# Altium schematic sheet WiFan.SchDoc: WiFan
size Letter; Author: Brandon Harris; Revision: 1.0; SheetNumber: 1; SheetTotal: 1; PageSetup: Record=PageOptions|CenterHorizontal=True|CenterVertical=True|PrintScale=0.62|XCorrection=1.00|YCorrection=1.00|PrintKind=0|BorderSize=5000000|LeftOffset=0|BottomOffset=0|Orientation=2|PaperLength=1000|PaperWidth=1000|Scale=100|PaperSource=7|PrintQuality=600|MediaType=1|DitherType=10|PaperKind=Tabloid|PrintScaleMode=1; ProjectName: WiFan
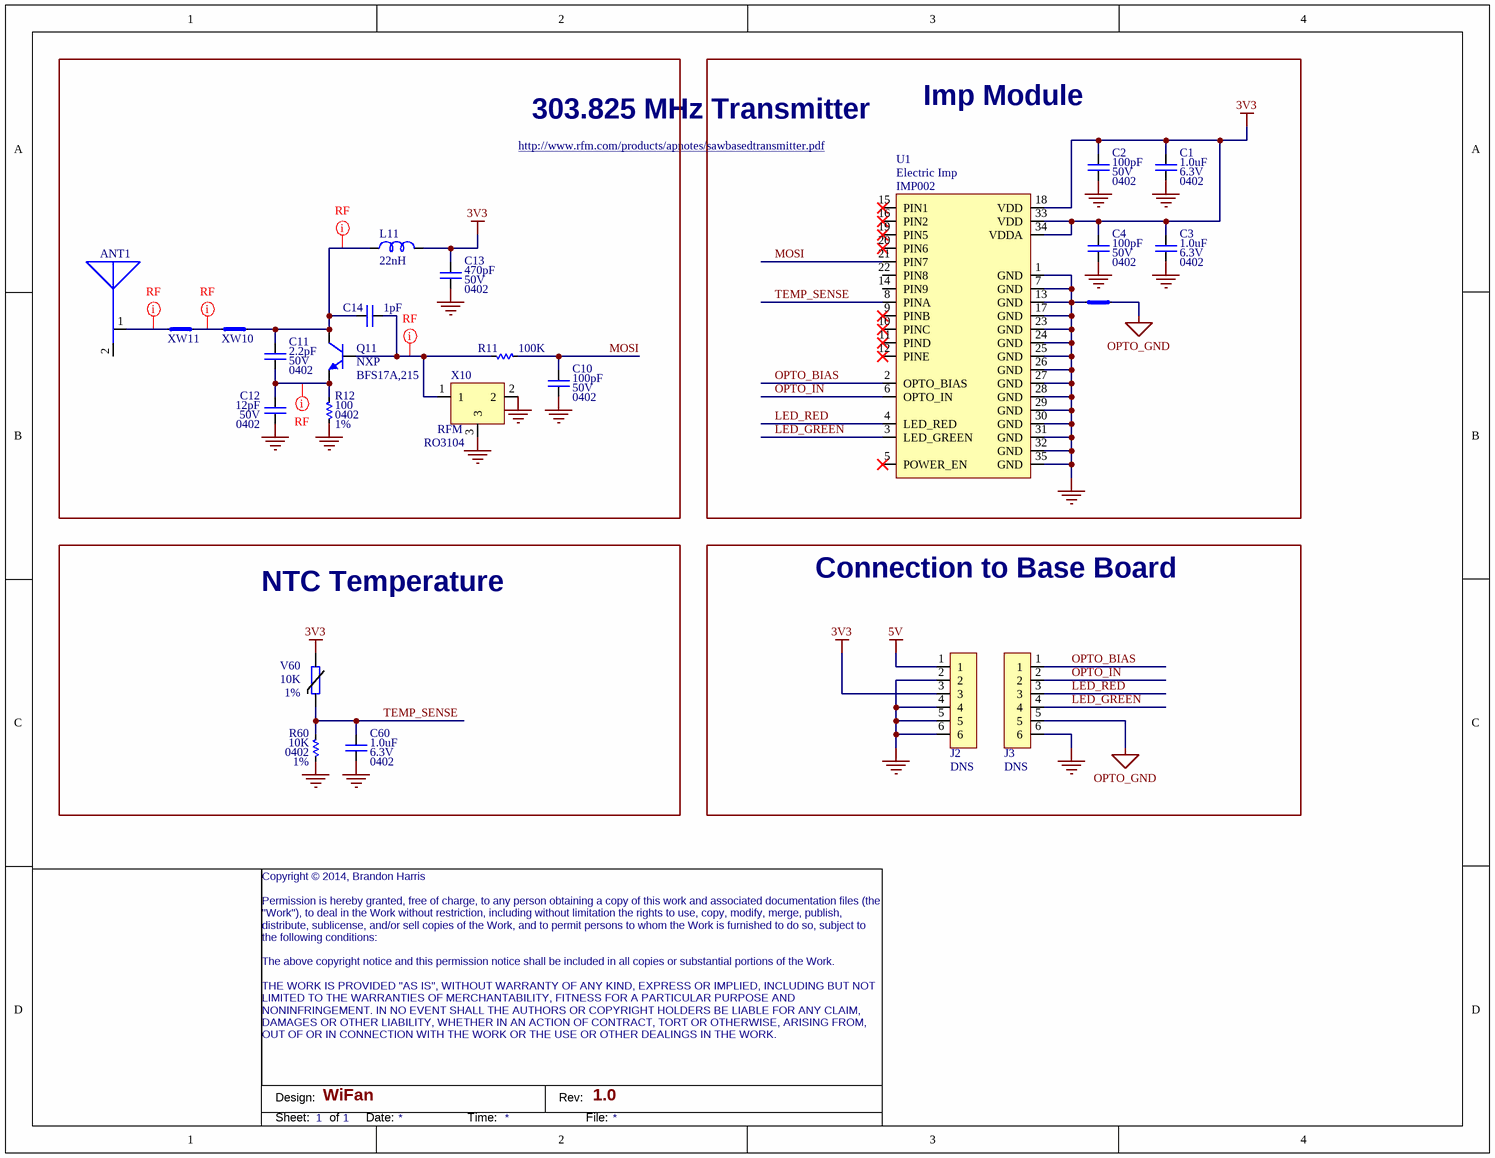
[diagram p0: WiFan.SchDoc]

## Parts
ANT1  ANT  [ANT-433-HETH]  (value not drawn)
C1  value 1.0uF  Voltage: 6.3V  Package: 0402  [CAPC1005X07N]  (hidden comment: Ceramic Capacitor)
C2  value 100pF  Voltage: 50V  Package: 0402  [CAPC1005X07N]  (hidden comment: Ceramic Capacitor)
C3  value 1.0uF  Voltage: 6.3V  Package: 0402  [CAPC1005X07N]  (hidden comment: Ceramic Capacitor)
C4  value 100pF  Voltage: 50V  Package: 0402  [CAPC1005X07N]  (hidden comment: Ceramic Capacitor)
C10  value 100pF  Voltage: 50V  Package: 0402  [CAPC1005X07N]  (hidden comment: Ceramic Capacitor)
C11  value 2.2pF  Voltage: 50V  Package: 0402  [CAPC1005X07N]  (hidden comment: Ceramic Capacitor)
C12  value 12pF  Voltage: 50V  Package: 0402  [CAPC1005X07N]  (hidden comment: Ceramic Capacitor)
C13  value 470pF  Voltage: 50V  Package: 0402  [CAPC1005X07N]  (hidden comment: Ceramic Capacitor)
C14  value 1pF  [CAPC1005X07N]  (hidden comment: Ceramic Capacitor)
C60  value 1.0uF  Voltage: 6.3V  Package: 0402  [CAPC1005X07N]  (hidden comment: Ceramic Capacitor)
J2  BOMOPTION: DNS  [HDR254P1X6-N]  (hidden comment: Header)  (no BOM)
J3  BOMOPTION: DNS  [HDR254P1X6-N]  (hidden comment: Header)  (no BOM)
L11  value 22nH  [INDC1005X06N]  (hidden comment: Inductor)
Q11  Manufacturer: NXP  Manufacturer Part Number: BFS17A,215  [SOT95P300X130-3N]  (hidden comment: NPN Bipolar Transistor)
R11  value 100K  [RESC1005X04N]  (hidden comment: Resistor)
R12  value 100  Package: 0402  Tolerance: 1%  [RESC1005X04N]  (hidden comment: Resistor)
R60  value 10K  Package: 0402  Tolerance: 1%  [RESC1005X04N]  (hidden comment: Resistor)
U1  Manufacturer: Electric Imp  Manufacturer Part Number: IMP002  [IMP_MODULE]  (hidden comment: imp module)
V60  value 10K  Precision: 1%  [HDR1X2]  (hidden comment: VARISTOR)
X10  Manufacturer: RFM  Manufacturer Part Number: RO3104  [TO39-3]  (hidden comment: RESONATOR-3N)
XW1  XW Link  [XW1005-COVERED]  (value not drawn)  (net tie, no BOM)
XW10  XW Link  [XW1005-UNCOVERED]  (value not drawn)  (net tie, no BOM)
XW11  XW Link  [XW1005-UNCOVERED]  (value not drawn)  (net tie, no BOM)

## Blocks framed on the sheet
303.825 MHz Transmitter: ANT1 C10-C14 L11 Q11 R11 R12 X10 XW10 XW11
Imp Module: C1-C4 U1 XW1
NTC Temperature: C60 R60 V60
Connection to Base Board: J2 J3

## Nets
3V3: C1.2 C2.2 C3.2 C4.2 C13.2 J2.3 L11.1 U1.18(VDD) U1.33(VDD) U1.34(VDDA) V60.1
5V: J2.1
GND: C1.1 C2.1 C3.1 C4.1 C10.1 C12.1 C13.1 C60.1 J2.2 J2.4 J2.5 J2.6 J3.6 R12.1 R60.1 U1.1(GND) U1.7(GND) U1.13(GND) U1.17(GND) U1.23(GND) U1.24(GND) U1.25(GND) U1.26(GND) U1.27(GND) U1.28(GND) U1.29(GND) U1.30(GND) U1.31(GND) U1.32(GND) U1.35(GND) X10.2 X10.3 XW1.1
OPTO_GND: J3.5 XW1.2
LED_GREEN: J3.4 U1.3(LED_GREEN)
LED_RED: J3.3 U1.4(LED_RED)
MOSI: C10.2 R11.1 U1.21(PIN7)
OPTO_BIAS: J3.1 U1.2(OPTO_BIAS)
OPTO_IN: J3.2 U1.6(OPTO_IN)
TEMP_SENSE: C60.2 R60.2 U1.8(PINA) V60.2
NetANT1_1: ANT1.1 XW11.2
NetC11_1: C11.1 C12.2 Q11.2(E) R12.2
NetC11_2: C11.2 C14.1 L11.2 Q11.3(C) XW10.1
NetC14_2: C14.2 Q11.1(B) R11.2 X10.1
NetXW10_2: XW10.2 XW11.1

Not connected (* = marked no-connect by the designer): ANT1 2; U1 5(POWER_EN)* 9(PINB)* 10(PINC)* 11(PIND)* 12(PINE)* 14(PIN9) 15(PIN1)* 16(PIN2)* 19(PIN5)* 20(PIN6)* 22(PIN8)

## Layout directives
net class RF: NetANT1_1, NetC11_1, NetC11_2, NetC14_2, NetXW10_2

## Notes on the sheet
- http://www.rfm.com/products/apnotes/sawbasedtransmitter.pdf
- Copyright © 2014, Brandon Harris
  Permission is hereby granted, free of charge, to any person obtaining a copy of this work and associated documentation files (the "Work"), to deal in the Work without restriction, including without limitation the rights to use, copy, modify, merge, publish, distribute, sublicense, and/or sell copies of the Work, and to permit persons to whom the Work is furnished to do so, subject to the following conditions:
  The above copyright notice and this permission notice shall be included in all copies or substantial portions of the Work.
  THE WORK IS PROVIDED "AS IS", WITHOUT WARRANTY OF ANY KIND, EXPRESS OR IMPLIED, INCLUDING BUT NOT LIMITED TO THE WARRANTIES OF MERCHANTABILITY, FITNESS FOR A PARTICULAR PURPOSE AND NONINFRINGEMENT. IN NO EVENT SHALL THE AUTHORS OR COPYRIGHT HOLDERS BE LIABLE FOR ANY CLAIM, DAMAGES OR OTHER LIABILITY, WHETHER IN AN ACTION OF CONTRACT, TORT OR OTHERWISE, ARISING FROM, OUT OF OR IN CONNECTION WITH THE WORK OR THE USE OR OTHER DEALINGS IN THE WORK.
- Design:
- Rev:
- Sheet:
- of
- Date:
- Time:
- File:

## Library data of the parts
ANT1 = ANT00001: Antenna, 433 MHz, through-hole, helical, air core; Manufacturer: Linx Technologies; Frequency: 433 MHz; Bands: 1; Part Number: ANT00001; Package: Through-hole; Type: Helical; Gain: -; VSWR: -; Manufacturer Part Number: ANT-433-HETH; Supplier 1: Digi-Key; Supplier Part Number 1: ANT-433-HETH-ND; Supplier Price 1: 0.675; ComponentLink1URL: http://www.digikey.com/product-detail/en/ANT-433-HETH/ANT-433-HETH-ND/625468
C1 C3 C60 = CAPC00005: CAP,X5R,1.0uF,10%,6.3V, 0402,#; Manufacturer: Murata; Manufacturer Part Number: GRM155R60J105KE19D; Tolerance: 10%; Dielectric: X5R; Part Number: CAPC00005; Manufacturer 2: Samsung; Manufacturer Part Number 2: CL05A105KQ5NNNC; Supplier 1: Digi-Key; Supplier Part Number 1: 490-1320-1-ND; Supplier Price 1: 0.0087; Supplier 2: Digi-Key; Supplier Part Number 2: 1276-1010-1-ND; Supplier Price 2: 0.009; Stock Quantity: 1000; Stock Date: 3/12/2013
C2 C4 C10 = CAPC00043: CAP,C0G,100pF,5%,50V,0402; Manufacturer: Yageo; Manufacturer Part Number: CC0402JRNPO9BN101; Tolerance: 5%; Dielectric: C0G; Part Number: CAPC00043; Manufacturer 2: Samsung; Manufacturer Part Number 2: CL05C101JB5NNNC; Supplier 1: Digi-Key; Supplier Part Number 1: 311-1024-1-ND; Supplier Price 1: 0.00324; Supplier 2: Digi-Key; Supplier Part Number 2: 1276-1025-1-ND; Supplier Price 2: 0.00324; Stock Quantity: 500; Stock Date: 3/12/2013
C11 = CAPC00080: CAP,C0G,2.2pF,+/-0.25pF,50V,0402; Manufacturer: Yageo; Manufacturer Part Number: CC0402CRNPO9BN2R2; Tolerance: 0.25p; Dielectric: C0G; Part Number: CAPC00080; Manufacturer 2: TDK; Manufacturer Part Number 2: CGA2B2C0G1H2R2C050BA; Supplier 1: Digi-Key; Supplier Part Number 1: 311-1354-1-ND; Supplier Price 1: 0.00426; Supplier 2: Digi-Key; Supplier Part Number 2: 445-5573-1-ND; Supplier Price 2: 0.015
C12 = CAPC00041: CAP,C0G,12pF,5%,50V,0402#; Manufacturer: Yageo; Manufacturer Part Number: CC0402JRNPO9BN120; Tolerance: 5%; Dielectric: C0G; Part Number: CAPC00041; Manufacturer 2: Murata; Manufacturer Part Number 2: GRM1555C1H120JZ01D; Supplier 1: Digi-Key; Supplier Part Number 1: 311-1016-1-ND; Supplier Price 1: 0.00324; Supplier 2: Digi-Key; Supplier Part Number 2: 490-1279-1-ND; Supplier Price 2: 0.00525
C13 = CAPC00047: CAP,C0G,470pF,5%,50V,0402; Manufacturer: TDK; Manufacturer Part Number: C1005C0G1H471J; Tolerance: 5%; Dielectric: C0G; Part Number: CAPC00047; Manufacturer 2: Murata; Manufacturer Part Number 2: GRM1555C1H471JA01D; Supplier 1: Digi-Key; Supplier Part Number 1: 445-2656-1-ND; Supplier Price 1: 0.0108; Supplier 2: Digi-Key; Supplier Part Number 2: 490-1297-1-ND; Supplier Price 2: 0.0177; Stock Quantity: 50; Stock Date: 5/6/2013
C14 = CAPC00081: CAP,NPO,1pF, 0402, 50V; Manufacturer: Samsung; Manufacturer Part Number: CL05C010CB5NNNC; Tolerance: 0.25p; Dielectric: C0G; Voltage: 50V; Package: 0402; Part Number: CAPC00081; Manufacturer 2: Murata; Manufacturer Part Number 2: GRM1555C1H1R0CA01D; Supplier 1: Digi-Key; Supplier Part Number 1: 1276-1595-1-ND; Supplier Price 1: 0.00432; Supplier 2: Digi-Key; Supplier Part Number 2: 490-3199-1-ND; Supplier Price 2: 0.00525
J2 J3 = HDR00020: Spacer, 1x6 Pin, 2.54mm Pitch, 0.661" Stack Height, Vertical, Through Hole; Manufacturer: Harwin; Manufacturer Part Number: M20-9610646; Gender: Male; Number of Columns: 6; Part Number: HDR00020; Connector Type: Spacer; Number of Rows: 1; Number of Positions Loaded: 6; Pitch: 2.54mm; Mounting Type: Through Hole; Orientation: Vertical; Contact Finish: Gold Flash; Supplier 1: Digi-Key; Supplier Part Number 1: 952-1981-ND; Supplier Price 1: 0.3723
L11 = IND00036: IND, 22nH, 5%, 300mA, 600 mOhm, 0402; Manufacturer: Taiyo Yuden; Manufacturer Part Number: HK100522NJ-T; Part Number: IND00036; Package: 0402; Current: 300mA; Current - Saturation: -; Current - Temperature Rise: -; Tolerance: 5%; DC Resistance (DCR): 600 mOhm; Supplier 1: Digi-Key; Supplier Part Number 1: 587-1523-1-ND; Supplier Price 1: 0.01125; ComponentLink1URL: http://www.digikey.com/product-detail/en/HK100522NJ-T/587-1523-1-ND/1008138
Q11 = NPN00003: NPN,15V, 25mA, 2.8GHz, SOT23; DC Current Gain (hFE) (Min) @ Ic, Vce: 25 @ 2mA, 1V; Power - Max: 300mW; Part Number: NPN00003; Package: SOT23; Current - Collector (Ic) (Max): 25mA; Voltage - Collector Emitter Breakdown (Max): 15V; Vce Saturation (Max) @ Ib, Ic: -; Current - Collector Cutoff (Max): -; Supplier 1: Digi-key; Supplier Part Number 1: 568-1653-1-ND; Supplier Price 1: 0.07066; ComponentLink1URL: http://www.digikey.com/product-detail/en/BFS17A,215/568-1653-1-ND/763480
R11 = RES00001: RES,100k,5%,0.063W,0402,#; Manufacturer: Samsung; Manufacturer Part Number: RC1005J104CS; Part Number: RES00001; Package: 0402; Tolerance: 5%; Power: 0.063W; Manufacturer 2: ROHM; Manufacturer Part Number 2: MCR01MRTJ104; Supplier 1: Digi-Key; Supplier Part Number 1: 1276-4424-1-ND; Supplier Price 1: 0.0023; Supplier 2: Digi-Key; Supplier Part Number 2: HM100KCECT-ND; Supplier Price 2: 0.00233; Stock Quantity: 2100; Stock Date: 4/5/2013
R12 = RES00024: RES,100 Ohm,1%,0.063W,0402,#; Manufacturer: Yageo; Manufacturer Part Number: RC0402FR-07100RL; Part Number: RES00024; Power: 0.063W; Manufacturer 2: ROHM; Manufacturer Part Number 2: MCR01MRTF1000; Supplier 1: Digi-Key; Supplier Part Number 1: 311-100LRCT-ND; Supplier Price 1: 0.0027; Supplier 2: Digi-Key; Supplier Part Number 2: RHM100CDCT-ND; Supplier Price 2: 0.0048; Stock Quantity: 1000; Stock Date: 4/5/2013
R60 = RES00020: RES,10K,1%,0.063W,0402,#; Manufacturer: Yageo; Manufacturer Part Number: RC0402FR-0710KL; Part Number: RES00020; Power: 0.063W; Manufacturer 2: ROHM; Manufacturer Part Number 2: MCR01MRTF1002; Supplier 1: Digi-Key; Supplier Part Number 1: 311-10.0KLRCT-ND; Supplier Price 1: 0.0027; Supplier 2: Digi-Key; Supplier Part Number 2: RHM10.0KCDCT-ND; Supplier Price 2: 0.0048
U1 = MOD00002: Module, Electric Imp Solder Down with Antenna; Part Number: MOD00002
V60 = NTC00008: Thermistor, NTC, 10K, 1%, Radial; Manufacturer: Murata; Manufacturer Part Number: NXFT15XH103FA2B025; Part Number: NTC00008; Supplier 1: Digi-Key; Supplier Part Number 1: 490-5628-ND; Supplier Price 1: 0.36594; ComponentLink1URL: http://www.digikey.com/product-detail/en/NXFT15XH103FA2B025/490-5628-ND/2533819
X10 = RESONATOR00001: Resonator,SAW,303.825MHz,TO39-3; Frequency Tolerance: 75KHz; Part Number: RESONATOR00001; Package: TO39-3; Frequency: 303.825; Supplier 1: Mouser; Supplier Part Number 1: 719-RO3104; Supplier Price 1: 1.02; ComponentLink1URL: http://www.mouser.com/ProductDetail/RFM/RO3104/?qs=sGAEpiMZZMsBj6bBr9Q9aYrwevm5J1GTXdeZFZ4Lhr4%3d
XW1 = ELEC00008: Short two wires together; Part Number: ELEC00008
XW10 XW11 = ELEC00007: Short two wires together; Part Number: ELEC00007